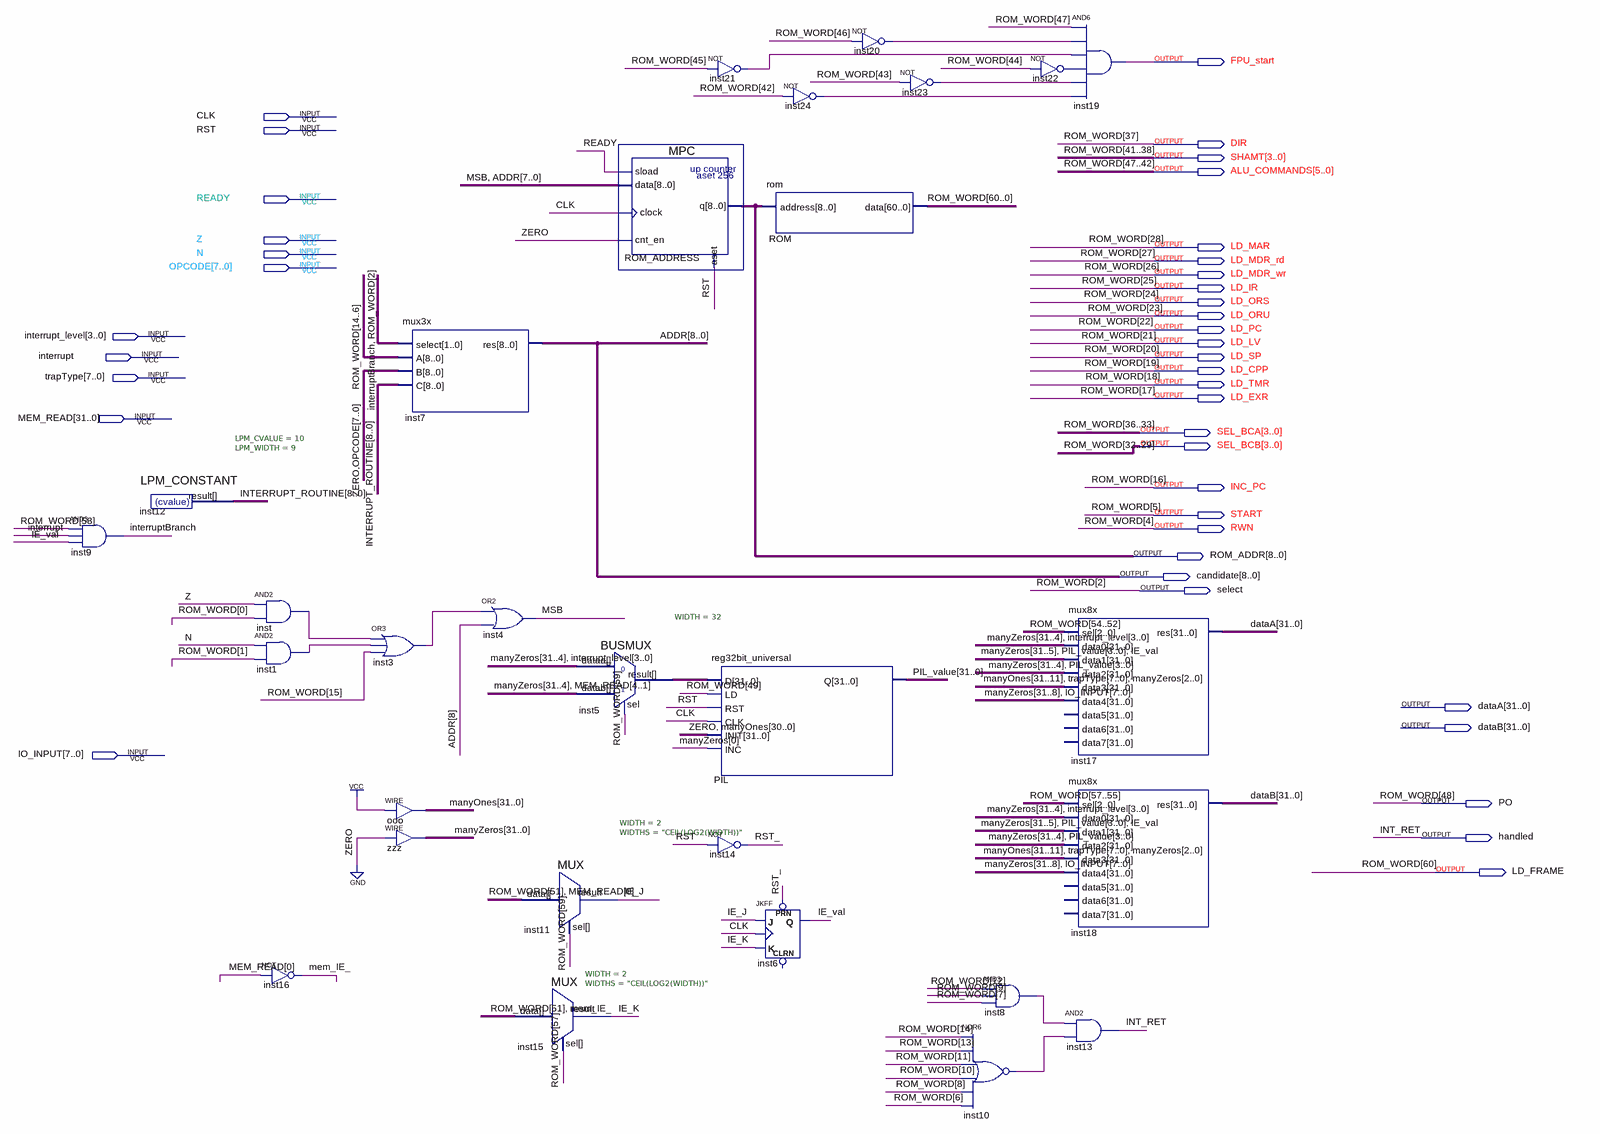
[diagram p0: schematic sheet]
// Quartus schematic CU.bdf as structural Verilog: 29 symbols, 40 pins
module CU (
  input  CLK,
  input  RST,
  input  READY,
  input  Z,
  input  N,
  input  [7:0] OPCODE,
  input  [3:0] interrupt_level,
  input  interrupt,
  input  [7:0] trapType,
  input  [31:0] MEM_READ,
  input  [7:0] IO_INPUT,
  output FPU_start,
  output DIR,
  output [3:0] SHAMT,
  output [5:0] ALU_COMMANDS,
  output LD_MAR,
  output LD_MDR_rd,
  output LD_MDR_wr,
  output LD_IR,
  output LD_ORS,
  output LD_ORU,
  output LD_PC,
  output LD_LV,
  output LD_SP,
  output LD_CPP,
  output LD_TMR,
  output LD_EXR,
  output [3:0] SEL_BCA,
  output [3:0] SEL_BCB,
  output INC_PC,
  output START,
  output RWN,
  output [8:0] ROM_ADDR,
  output [8:0] candidate,
  output select,
  output [31:0] dataA,
  output [31:0] dataB,
  output PO,
  output handled,
  output LD_FRAME
);

  wire IE_J, IE_K, IE_val, inst1_out, inst3_out, inst8_out, inst10_out, inst20_out, inst21_out, inst22_out,
       inst23_out, inst24_out, inst_out, interruptBranch, mem_IE_, MSB, RST_;
  wire [8:0] INTERRUPT_ROUTINE;
  wire [31:0] inst5_result, manyOnes, manyZeros, PIL_value;
  wire [59:0] ROM_WORD;

  and inst9 (interruptBranch, ROM_WORD[58], interrupt, IE_val);
  LPM_CONSTANT #(.LPM_CVALUE(10), .LPM_WIDTH(9)) inst12 (.result(INTERRUPT_ROUTINE));
  and inst (inst_out, Z, ROM_WORD[0]);
  and inst1 (inst1_out, N, ROM_WORD[1]);
  not inst16 (mem_IE_, MEM_READ[0]);
  mux3x inst7 (
    .select({interruptBranch, select}), .A(ROM_WORD[14:6]), .B({1'b0, OPCODE}), .C(INTERRUPT_ROUTINE),
    .res(candidate));
  or inst3 (inst3_out, inst_out, inst1_out, ROM_WORD[15]);
  assign manyOnes = {32{1'b1}};  // WIRE ooo
  assign manyZeros = {32{1'b0}};  // WIRE zzz
  or inst4 (MSB, inst3_out, candidate[8]);
  MUX #(.WIDTH(2), .WIDTHS("CEIL(LOG2(WIDTH))")) inst11 (
    .data({ROM_WORD[51], MEM_READ[0]}), .sel(ROM_WORD[59]), .result(IE_J));
  MUX #(.WIDTH(2), .WIDTHS("CEIL(LOG2(WIDTH))")) inst15 (
    .data({ROM_WORD[51], mem_IE_}), .sel(ROM_WORD[57]), .result(IE_K));
  BUSMUX #(.WIDTH(32)) inst5 (
    .datab({manyZeros[31:4], MEM_READ[4:1]}), .sel(ROM_WORD[59]), .dataa({manyZeros[31:4], interrupt_level}),
    .result(inst5_result));
  MPC ROM_ADDRESS (.sload(READY), .data({MSB, candidate[7:0]}), .clock(CLK), .cnt_en(1'b0), .aset(RST), .q(ROM_ADDR));
  not inst21 (inst21_out, ALU_COMMANDS[3]);
  reg32bit_universal PIL (
    .D(inst5_result), .LD(ROM_WORD[49]), .RST(RST), .CLK(CLK), .INIT({1'b0, manyOnes[30:0]}),
    .INC(manyZeros[0]), .Q(PIL_value));
  not inst14 (RST_, RST);
  not inst24 (inst24_out, ALU_COMMANDS[0]);
  rom ROM (
    .address(ROM_ADDR),
    .data({LD_FRAME, ROM_WORD[59:49], PO, ALU_COMMANDS, SHAMT, DIR, SEL_BCA, SEL_BCB, LD_MAR, LD_MDR_rd, LD_MDR_wr, LD_IR, LD_ORS, LD_ORU, LD_PC, LD_LV, LD_SP, LD_CPP, LD_TMR, LD_EXR, INC_PC, ROM_WORD[15:6], START, RWN, ROM_WORD[3], select, ROM_WORD[1:0]}));
  JKFF inst6 (.PRN(RST_), .K(IE_K), .J(IE_J), .CLK(CLK), .Q(IE_val));  // open: CLRN
  not inst20 (inst20_out, ALU_COMMANDS[4]);
  not inst23 (inst23_out, ALU_COMMANDS[1]);
  nor inst10 (inst10_out, ROM_WORD[14], ROM_WORD[13], ROM_WORD[11], ROM_WORD[10], ROM_WORD[8], ROM_WORD[6]);
  and inst8 (inst8_out, ROM_WORD[12], ROM_WORD[9], ROM_WORD[7]);
  and inst19 (FPU_start, ALU_COMMANDS[5], inst20_out, inst21_out, inst22_out, inst23_out, inst24_out);
  not inst22 (inst22_out, ALU_COMMANDS[2]);
  mux8x inst17 (
    .sel(ROM_WORD[54:52]), .data0({manyZeros[31:4], interrupt_level}),
    .data1({manyZeros[31:5], PIL_value[3:0], IE_val}), .data2({manyZeros[31:4], PIL_value[3:0]}),
    .data3({manyOnes[31:11], trapType, manyZeros[2:0]}), .data4({manyZeros[31:8], IO_INPUT}), .res(dataA));  // open: data5, data6, data7
  mux8x inst18 (
    .sel(ROM_WORD[57:55]), .data0({manyZeros[31:4], interrupt_level}),
    .data1({manyZeros[31:5], PIL_value[3:0], IE_val}), .data2({manyZeros[31:4], PIL_value[3:0]}),
    .data3({manyOnes[31:11], trapType, manyZeros[2:0]}), .data4({manyZeros[31:8], IO_INPUT}), .res(dataB));  // open: data5, data6, data7
  and inst13 (handled, inst8_out, inst10_out);

  // Other names for the same wires on the sheet: ADDR[8:0] = candidate; INT_RET = handled;
  //   ROM_WORD (some bits) = {LD_FRAME, PO, ALU_COMMANDS, SHAMT, DIR, SEL_BCA, SEL_BCB, LD_MAR, LD_MDR_rd, LD_MDR_wr, LD_IR, LD_ORS, LD_ORU, LD_PC, LD_LV, LD_SP, LD_CPP, LD_TMR, LD_EXR, INC_PC, START, RWN, select}
endmodule
